# Altium project Rp2040.PrjPcb
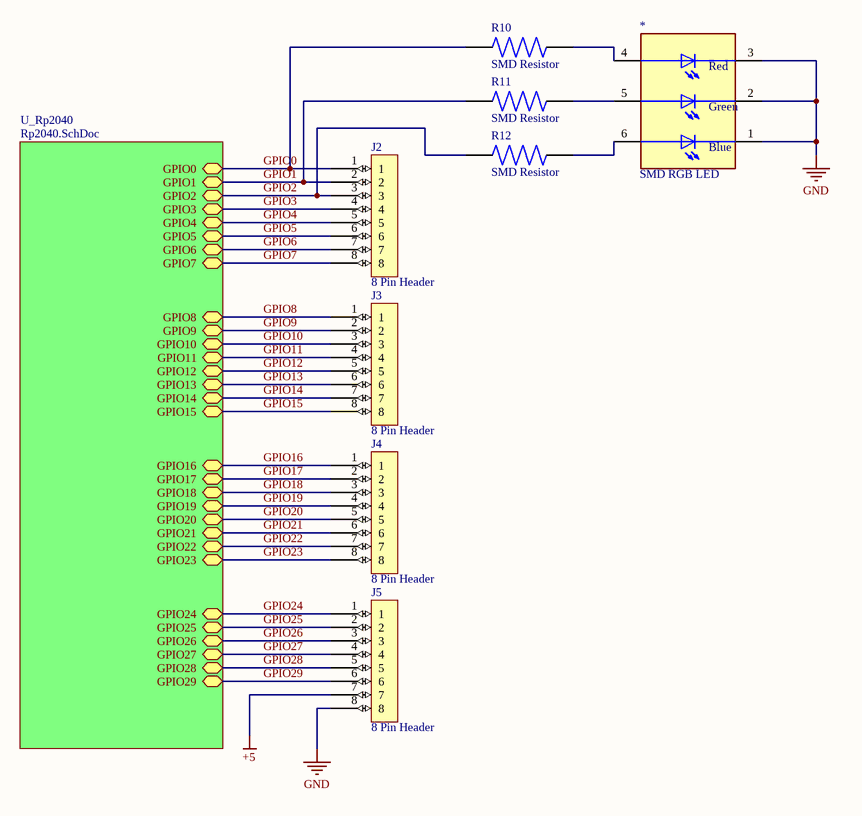
[diagram p0: Top.SchDoc]
6 sheets, 42 parts. Net scope: hierarchical (ports join the sheet entries above them; power ports are global).
Board file: PCB1.PcbDoc
Sheets:
  Top.SchDoc
    U_Rp2040 = Rp2040.SchDoc
      U_USB = USB.SchDoc
      U_Crystal = Crystal.SchDoc
      U_Flash = Flash.SchDoc
      U_Power = Power.SchDoc

## Sheet Top.SchDoc
size A4; SheetNumber: 1; SheetTotal: 6

### Parts
*  SMD RGB LED  [SMD RGB LED-Footprint-1]
J2  8 Pin Header  [8 Pin Header-Footprint-1]
J3  8 Pin Header  [8 Pin Header-Footprint-1]
J4  8 Pin Header  [8 Pin Header-Footprint-1]
J5  8 Pin Header  [8 Pin Header-Footprint-1]
R10  SMD Resistor  [SMD Resistor-Footprint-1]
R11  SMD Resistor  [SMD Resistor-Footprint-1]
R12  SMD Resistor  [SMD Resistor-Footprint-1]

### Sub-sheets
U_Rp2040 = Rp2040.SchDoc: GPIO0 (bidir), GPIO1 (bidir), GPIO2 (bidir), GPIO3 (bidir), GPIO4 (bidir), GPIO5 (bidir), GPIO6 (bidir), GPIO7 (bidir), GPIO8 (bidir), GPIO9 (bidir), GPIO10 (bidir), GPIO11 (bidir), GPIO12 (bidir), GPIO13 (bidir), GPIO14 (bidir), GPIO15 (bidir), GPIO16 (bidir), GPIO17 (bidir), GPIO18 (bidir), GPIO19 (bidir), GPIO20 (bidir), GPIO21 (bidir), GPIO22 (bidir), GPIO23 (bidir), GPIO24 (bidir), GPIO25 (bidir), GPIO26 (bidir), GPIO27 (bidir), GPIO28 (bidir), GPIO29 (bidir)

### Nets
+5: J5.7
GND: *.1 *.2 *.3 J5.8
GPIO0: J2.1 R10.1 ; sheet U_Rp2040/GPIO0
GPIO1: J2.2 R11.1 ; sheet U_Rp2040/GPIO1
GPIO2: J2.3 R12.1 ; sheet U_Rp2040/GPIO2
GPIO3: J2.4 ; sheet U_Rp2040/GPIO3
GPIO4: J2.5 ; sheet U_Rp2040/GPIO4
GPIO5: J2.6 ; sheet U_Rp2040/GPIO5
GPIO6: J2.7 ; sheet U_Rp2040/GPIO6
GPIO7: J2.8 ; sheet U_Rp2040/GPIO7
GPIO8: J3.1 ; sheet U_Rp2040/GPIO8
GPIO9: J3.2 ; sheet U_Rp2040/GPIO9
GPIO10: J3.3 ; sheet U_Rp2040/GPIO10
GPIO11: J3.4 ; sheet U_Rp2040/GPIO11
GPIO12: J3.5 ; sheet U_Rp2040/GPIO12
GPIO13: J3.6 ; sheet U_Rp2040/GPIO13
GPIO14: J3.7 ; sheet U_Rp2040/GPIO14
GPIO15: J3.8 ; sheet U_Rp2040/GPIO15
GPIO16: J4.1 ; sheet U_Rp2040/GPIO16
GPIO17: J4.2 ; sheet U_Rp2040/GPIO17
GPIO18: J4.3 ; sheet U_Rp2040/GPIO18
GPIO19: J4.4 ; sheet U_Rp2040/GPIO19
GPIO20: J4.5 ; sheet U_Rp2040/GPIO20
GPIO21: J4.6 ; sheet U_Rp2040/GPIO21
GPIO22: J4.7 ; sheet U_Rp2040/GPIO22
GPIO23: J4.8 ; sheet U_Rp2040/GPIO23
GPIO24: J5.1 ; sheet U_Rp2040/GPIO24
GPIO25: J5.2 ; sheet U_Rp2040/GPIO25
GPIO26: J5.3 ; sheet U_Rp2040/GPIO26
GPIO27: J5.4 ; sheet U_Rp2040/GPIO27
GPIO28: J5.5 ; sheet U_Rp2040/GPIO28
GPIO29: J5.6 ; sheet U_Rp2040/GPIO29
Net*_4: *.4 R10.2
Net*_5: *.5 R11.2
Net*_6: *.6 R12.2

### Notes on the sheet
- (in symbol CMP-00015-1) Red; Green; Blue

### Library data of the parts
* = CMP-00015-1
J2-J5 = CMP-00039-2: 8 Pin Breakout Header
R10-R12 = CMP-00019-4: Generic SMD Resistor

## Sheet Rp2040.SchDoc
size A4; SheetNumber: 2; SheetTotal: 6
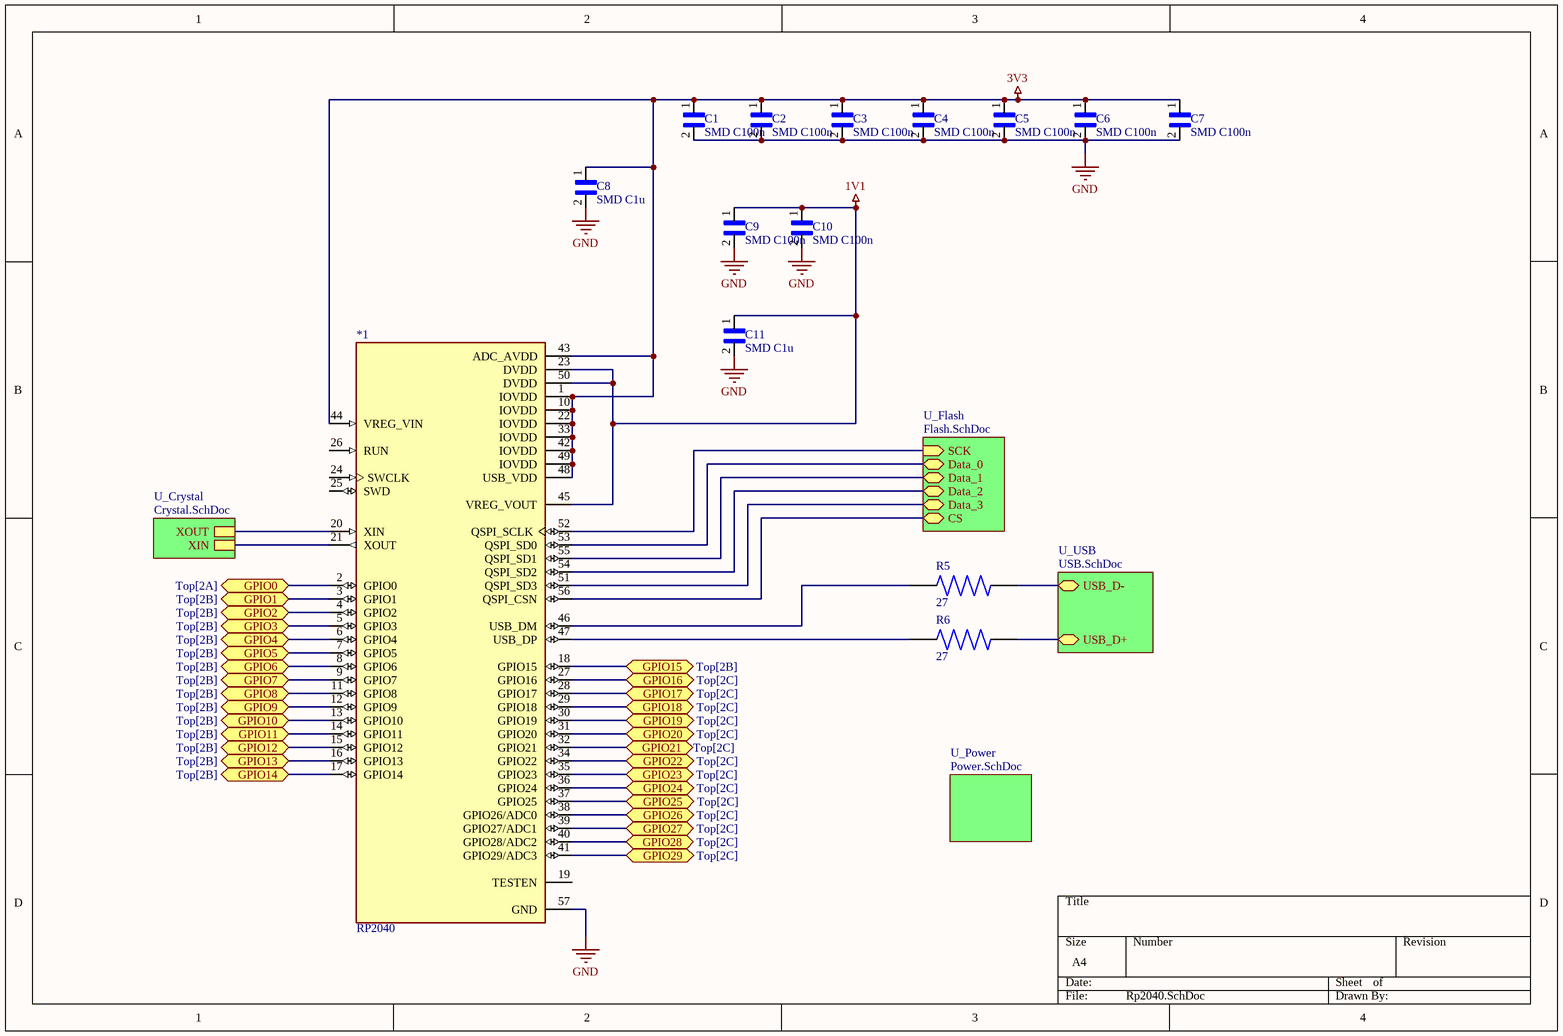
[diagram p1: Rp2040.SchDoc]

### Parts
*1  RP2040  [RP2040-Footprint-1]
C1  SMD C100n  [SMD Capacetor-Footprint-1]
C2  SMD C100n  [SMD Capacetor-Footprint-1]
C3  SMD C100n  [SMD Capacetor-Footprint-1]
C4  SMD C100n  [SMD Capacetor-Footprint-1]
C5  SMD C100n  [SMD Capacetor-Footprint-1]
C6  SMD C100n  [SMD Capacetor-Footprint-1]
C7  SMD C100n  [SMD Capacetor-Footprint-1]
C8  SMD C1u  [SMD Capacetor-Footprint-1]
C9  SMD C100n  [SMD Capacetor-Footprint-1]
C10  SMD C100n  [SMD Capacetor-Footprint-1]
C11  SMD C1u  [SMD Capacetor-Footprint-1]
R5  27  [SMD Resistor-Footprint-1]
R6  27  [SMD Resistor-Footprint-1]

### Sub-sheets
U_Crystal = Crystal.SchDoc: XIN, XOUT
U_Flash = Flash.SchDoc: SCK (in), Data_0 (bidir), Data_1 (bidir), Data_2 (bidir), Data_3 (bidir), CS (bidir)
U_Power = Power.SchDoc: no entries
U_USB = USB.SchDoc: USB_D+ (bidir), USB_D- (bidir)

### Ports
GPIO0 (bidir, see Top[2A]), GPIO1 (bidir, see Top[2B]), GPIO2 (bidir, see Top[2B]), GPIO3 (bidir, see Top[2B]), GPIO4 (bidir, see Top[2B]), GPIO5 (bidir, see Top[2B]), GPIO6 (bidir, see Top[2B]), GPIO7 (bidir, see Top[2B]), GPIO8 (bidir, see Top[2B]), GPIO9 (bidir, see Top[2B]), GPIO10 (bidir, see Top[2B]), GPIO11 (bidir, see Top[2B]), GPIO12 (bidir, see Top[2B]), GPIO13 (bidir, see Top[2B]), GPIO14 (bidir, see Top[2B]), GPIO15 (bidir, see Top[2B]), GPIO16 (bidir, see Top[2C]), GPIO17 (bidir, see Top[2C]), GPIO18 (bidir, see Top[2C]), GPIO19 (bidir, see Top[2C]), GPIO20 (bidir, see Top[2C]), GPIO21 (bidir, see Top[2C]), GPIO22 (bidir, see Top[2C]), GPIO23 (bidir, see Top[2C]), GPIO24 (bidir, see Top[2C]), GPIO25 (bidir, see Top[2C]), GPIO26 (bidir, see Top[2C]), GPIO27 (bidir, see Top[2C]), GPIO28 (bidir, see Top[2C]), GPIO29 (bidir, see Top[2C])

### Nets
1V1: *1.23(DVDD) *1.45(VREG_VOUT) *1.50(DVDD) C9.1 C10.1 C11.1
3V3: *1.1(IOVDD) *1.10(IOVDD) *1.22(IOVDD) *1.33(IOVDD) *1.42(IOVDD) *1.43(ADC_AVDD) *1.44(VREG_VIN) *1.48(USB_VDD) *1.49(IOVDD) C1.1 C2.1 C3.1 C4.1 C5.1 C6.1 C7.1 C8.1
GND: *1.57(GND) C1.2 C2.2 C3.2 C4.2 C5.2 C6.2 C7.2 C8.2 C9.2 C10.2 C11.2
GPIO0: *1.2(GPIO0) ; port GPIO0
GPIO1: *1.3(GPIO1) ; port GPIO1
GPIO2: *1.4(GPIO2) ; port GPIO2
GPIO3: *1.5(GPIO3) ; port GPIO3
GPIO4: *1.6(GPIO4) ; port GPIO4
GPIO5: *1.7(GPIO5) ; port GPIO5
GPIO6: *1.8(GPIO6) ; port GPIO6
GPIO7: *1.9(GPIO7) ; port GPIO7
GPIO8: *1.11(GPIO8) ; port GPIO8
GPIO9: *1.12(GPIO9) ; port GPIO9
GPIO10: *1.13(GPIO10) ; port GPIO10
GPIO11: *1.14(GPIO11) ; port GPIO11
GPIO12: *1.15(GPIO12) ; port GPIO12
GPIO13: *1.16(GPIO13) ; port GPIO13
GPIO14: *1.17(GPIO14) ; port GPIO14
GPIO15: *1.18(GPIO15) ; port GPIO15
GPIO16: *1.27(GPIO16) ; port GPIO16
GPIO17: *1.28(GPIO17) ; port GPIO17
GPIO18: *1.29(GPIO18) ; port GPIO18
GPIO19: *1.30(GPIO19) ; port GPIO19
GPIO20: *1.31(GPIO20) ; port GPIO20
GPIO21: *1.32(GPIO21) ; port GPIO21
GPIO22: *1.34(GPIO22) ; port GPIO22
GPIO23: *1.35(GPIO23) ; port GPIO23
GPIO24: *1.36(GPIO24) ; port GPIO24
GPIO25: *1.37(GPIO25) ; port GPIO25
GPIO26: *1.38(GPIO26/ADC0) ; port GPIO26
GPIO27: *1.39(GPIO27/ADC1) ; port GPIO27
GPIO28: *1.40(GPIO28/ADC2) ; port GPIO28
GPIO29: *1.41(GPIO29/ADC3) ; port GPIO29
Net*1_20: *1.20(XIN) ; sheet U_Crystal/XOUT
Net*1_21: *1.21(XOUT) ; sheet U_Crystal/XIN
Net*1_46: *1.46(USB_DM) R5.1
Net*1_47: *1.47(USB_DP) R6.1
Net*1_51: *1.51(QSPI_SD3) ; sheet U_Flash/Data_3
Net*1_52: *1.52(QSPI_SCLK) ; sheet U_Flash/SCK
Net*1_53: *1.53(QSPI_SD0) ; sheet U_Flash/Data_0
Net*1_54: *1.54(QSPI_SD2) ; sheet U_Flash/Data_2
Net*1_55: *1.55(QSPI_SD1) ; sheet U_Flash/Data_1
Net*1_56: *1.56(QSPI_CSN) ; sheet U_Flash/CS
NetJ1_A6: R6.2 ; sheet U_USB/USB_D+
NetJ1_A7: R5.2 ; sheet U_USB/USB_D-

Not connected (* = marked no-connect by the designer): *1 19(TESTEN) 24(SWCLK) 25(SWD) 26(RUN)

### Library data of the parts
*1 = CMP-00016-1: Microprocessor
C1-C7 C9 C10 = CMP-00017-4: Generic SMD Capacetor
C8 C11 = CMP-00052-1: Generic SMD Capacetor
R5 R6 = CMP-00019-4: Generic SMD Resistor

## Sheet USB.SchDoc
size A4; SheetNumber: 1; SheetTotal: 1
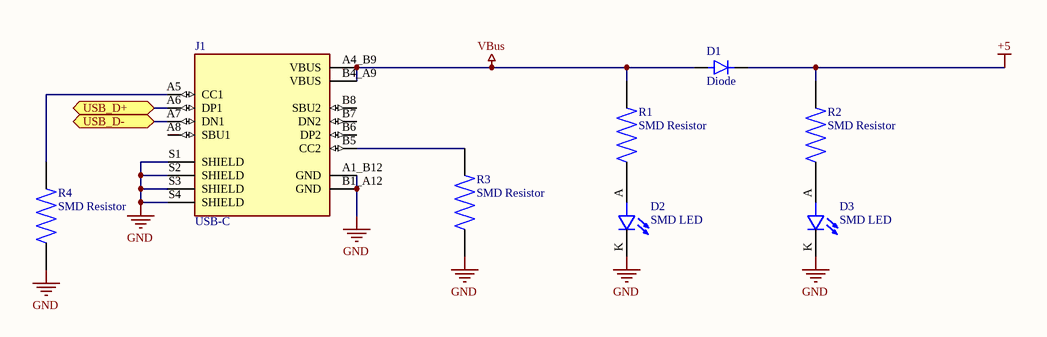
[diagram p2: USB.SchDoc]

### Parts
D1  Diode  [Diode-Footprint-1]
D2  SMD LED  [SMD LED-Footprint-1]
D3  SMD LED  [SMD LED-Footprint-1]
J1  USB-C  [USB-C-Footprint-1]
R1  SMD Resistor  [SMD Resistor-Footprint-1]
R2  SMD Resistor  [SMD Resistor-Footprint-1]
R3  SMD Resistor  [SMD Resistor-Footprint-1]
R4  SMD Resistor  [SMD Resistor-Footprint-1]

### Ports
USB_D+ (bidir), USB_D- (bidir)

### Nets
+5: D1.K R2.1
GND: D2.K(C) D3.K(C) J1.A1_B12(GND) J1.B1_A12(GND) J1.S1(SHIELD) J1.S2(SHIELD) J1.S3(SHIELD) J1.S4(SHIELD) R3.2 R4.2
VBus: D1.A J1.A4_B9(VBUS) J1.B4_A9(VBUS) R1.1
NetD2_A: D2.A R1.2
NetD3_A: D3.A R2.2
NetJ1_A5: J1.A5(CC1) R4.1
NetJ1_A6: J1.A6(DP1) ; port USB_D+
NetJ1_A7: J1.A7(DN1) ; port USB_D-
NetJ1_B5: J1.B5(CC2) R3.1

Not connected (* = marked no-connect by the designer): J1 A8(SBU1) B6(DP2) B7(DN2) B8(SBU2)

### Library data of the parts
D1 = CMP-00008-1: Generic Diode
D2 D3 = CMP-00018-3: Generic SMD LED
J1 = CMP-00020-5: USB-C Connector
R1-R4 = CMP-00019-2: Generic SMD Resistor

## Sheet Crystal.SchDoc
size A4; SheetNumber: 5; SheetTotal: 5
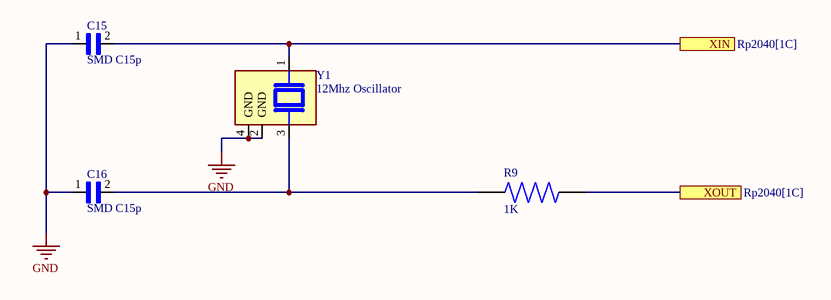
[diagram p3: Crystal.SchDoc]

### Parts
C15  SMD C15p  [SMD Capacetor-Footprint-1]
C16  SMD C15p  [SMD Capacetor-Footprint-1]
R9  1K  [SMD Resistor-Footprint-1]
Y1  12Mhz Oscillator  [12Mhz Oscillator-Footprint-1]

### Ports
XIN (see Rp2040[1C]), XOUT (see Rp2040[1C])

### Nets
GND: C15.1 C16.1 Y1.2(GND) Y1.4(GND)
Net*1_20: R9.2 ; port XOUT
Net*1_21: C15.2 Y1.1 ; port XIN
NetC16_2: C16.2 R9.1 Y1.3

### Library data of the parts
C15 C16 = CMP-00051-2: Generic SMD Capacetor
R9 = CMP-00019-4: Generic SMD Resistor
Y1 = CMP-00003-1: 12 Mhz Oscillator SMD

## Sheet Flash.SchDoc
size A4; SheetNumber: 3; SheetTotal: 5
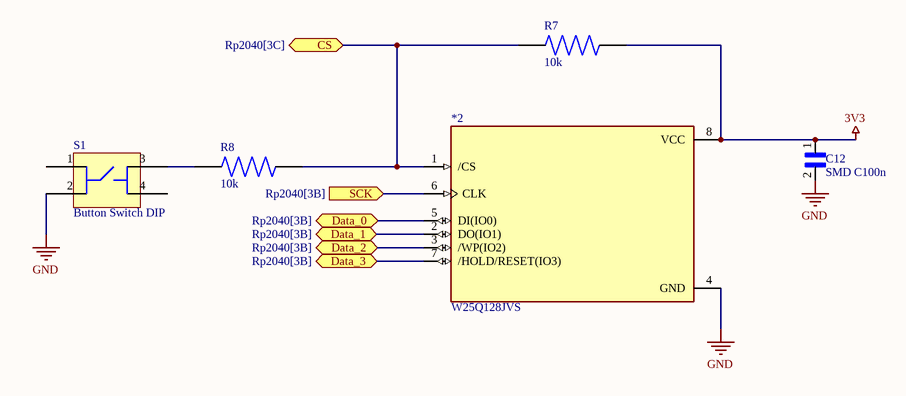
[diagram p4: Flash.SchDoc]

### Parts
*2  W25Q128JVS  [W25Q128JVS-Footprint-1]
C12  SMD C100n  [SMD Capacetor-Footprint-1]
R7  10k  [SMD Resistor-Footprint-1]
R8  10k  [SMD Resistor-Footprint-1]
S1  Button Switch DIP  [Button Switch DIP -Footprint-1]

### Ports
CS (bidir, see Rp2040[3C]), Data_0 (bidir, see Rp2040[3B]), Data_1 (bidir, see Rp2040[3B]), Data_2 (bidir, see Rp2040[3B]), Data_3 (bidir, see Rp2040[3B]), SCK (in, see Rp2040[3B])

### Nets
3V3: *2.8(VCC) C12.1 R7.2
GND: *2.4(GND) C12.2 S1.2
Net*1_51: *2.7(/HOLD/RESET(IO3)) ; port Data_3
Net*1_52: *2.6(CLK) ; port SCK
Net*1_53: *2.5(DI(IO0)) ; port Data_0
Net*1_54: *2.3(/WP(IO2)) ; port Data_2
Net*1_55: *2.2(DO(IO1)) ; port Data_1
Net*1_56: *2.1(/CS) R7.1 R8.2 ; port CS
NetR8_1: R8.1 S1.3

Not connected (* = marked no-connect by the designer): S1 1 4

### Library data of the parts
*2 = CMP-00021-1: Flash Memory
C12 = CMP-00017-4: Generic SMD Capacetor
R7 R8 = CMP-00019-2: Generic SMD Resistor
S1 = CMP-00005-1: 4 Pin

## Sheet Power.SchDoc
size A4; SheetNumber: 4; SheetTotal: 5
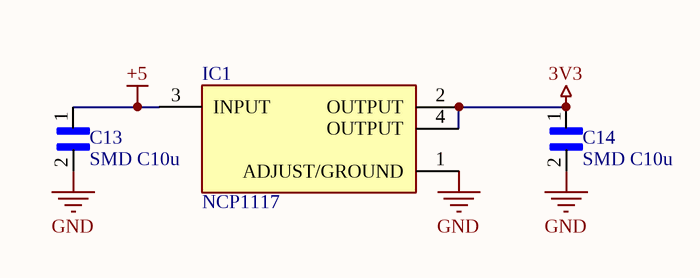
[diagram p5: Power.SchDoc]

### Parts
C13  SMD C10u  [SMD Capacetor-Footprint-1]
C14  SMD C10u  [SMD Capacetor-Footprint-1]
IC1  NCP1117  [NCP1117-Footprint-1]

### Nets
3V3: C14.1 IC1.2(OUTPUT) IC1.4(OUTPUT)
+5: C13.1 IC1.3(INPUT)
GND: C13.2 C14.2 IC1.1(ADJUST/GROUND)

### Library data of the parts
C13 C14 = CMP-00053-1: Generic SMD Capacetor
IC1 = CMP-00010-1: Voltage Stabalizer

## Nets that join several sheets
3V3: Rp2040 (17 pins), Flash (*2.8 C12.1 R7.2), Power (C14.1 IC1.2 IC1.4)
+5: Top (J5.7), USB (D1.K R2.1), Power (C13.1 IC1.3)
GND: Top (*.1 *.2 *.3 J5.8), Rp2040 (12 pins), USB (10 pins), Crystal (C15.1 C16.1 Y1.2 Y1.4), Flash (*2.4 C12.2 S1.2), Power (C13.2 C14.2 IC1.1)
GPIO0: Top (J2.1 R10.1), Rp2040 (*1.2)
GPIO1: Top (J2.2 R11.1), Rp2040 (*1.3)
GPIO2: Top (J2.3 R12.1), Rp2040 (*1.4)
GPIO3: Top (J2.4), Rp2040 (*1.5)
GPIO4: Top (J2.5), Rp2040 (*1.6)
GPIO5: Top (J2.6), Rp2040 (*1.7)
GPIO6: Top (J2.7), Rp2040 (*1.8)
GPIO7: Top (J2.8), Rp2040 (*1.9)
GPIO8: Top (J3.1), Rp2040 (*1.11)
GPIO9: Top (J3.2), Rp2040 (*1.12)
GPIO10: Top (J3.3), Rp2040 (*1.13)
GPIO11: Top (J3.4), Rp2040 (*1.14)
GPIO12: Top (J3.5), Rp2040 (*1.15)
GPIO13: Top (J3.6), Rp2040 (*1.16)
GPIO14: Top (J3.7), Rp2040 (*1.17)
GPIO15: Top (J3.8), Rp2040 (*1.18)
GPIO16: Top (J4.1), Rp2040 (*1.27)
GPIO17: Top (J4.2), Rp2040 (*1.28)
GPIO18: Top (J4.3), Rp2040 (*1.29)
GPIO19: Top (J4.4), Rp2040 (*1.30)
GPIO20: Top (J4.5), Rp2040 (*1.31)
GPIO21: Top (J4.6), Rp2040 (*1.32)
GPIO22: Top (J4.7), Rp2040 (*1.34)
GPIO23: Top (J4.8), Rp2040 (*1.35)
GPIO24: Top (J5.1), Rp2040 (*1.36)
GPIO25: Top (J5.2), Rp2040 (*1.37)
GPIO26: Top (J5.3), Rp2040 (*1.38)
GPIO27: Top (J5.4), Rp2040 (*1.39)
GPIO28: Top (J5.5), Rp2040 (*1.40)
GPIO29: Top (J5.6), Rp2040 (*1.41)
Net*1_20: Rp2040 (*1.20), Crystal (R9.2)
Net*1_21: Rp2040 (*1.21), Crystal (C15.2 Y1.1)
Net*1_51: Rp2040 (*1.51), Flash (*2.7)
Net*1_52: Rp2040 (*1.52), Flash (*2.6)
Net*1_53: Rp2040 (*1.53), Flash (*2.5)
Net*1_54: Rp2040 (*1.54), Flash (*2.3)
Net*1_55: Rp2040 (*1.55), Flash (*2.2)
Net*1_56: Rp2040 (*1.56), Flash (*2.1 R7.1 R8.2)
NetJ1_A6: Rp2040 (R6.2), USB (J1.A6)
NetJ1_A7: Rp2040 (R5.2), USB (J1.A7)